# Altium schematic sheet em_storage.SchDoc
size A; SheetNumber: 5; SheetTotal: 9
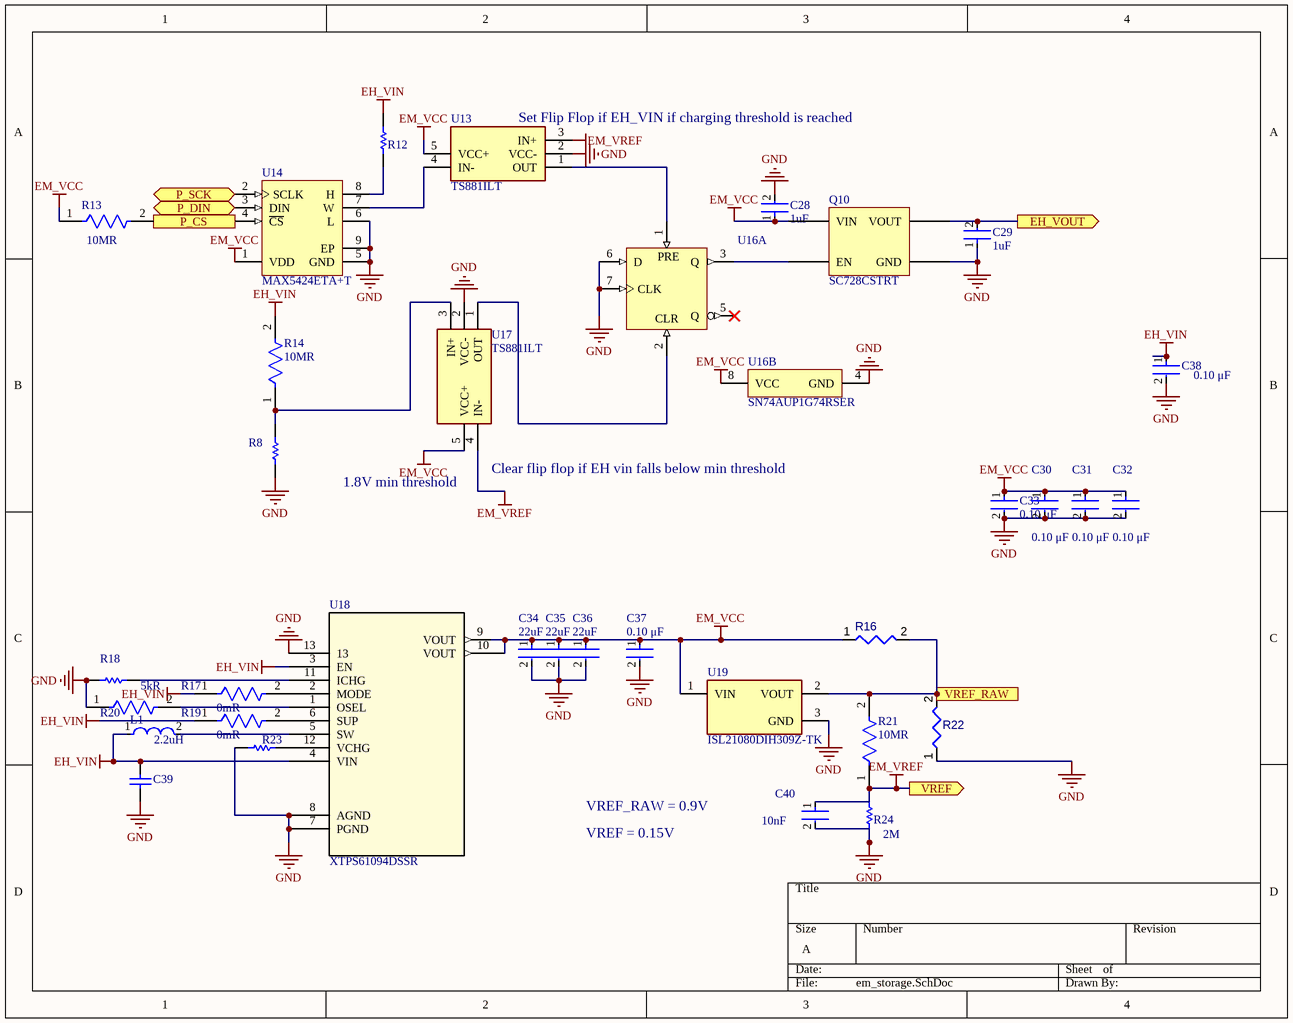
[diagram p0: em_storage.SchDoc]

## Parts
C28  Capacitance: 1uF  [FP-GRM15-0_1-MFG]  (hidden comment: GRT155R61C105KE01J)
C29  Capacitance: 1uF  [FP-GRM15-0_1-MFG]  (hidden comment: GRT155R61C105KE01J)
C30  Capacitance: 0.10 μF  [FP-C0402-BB-MFG]  (hidden comment: C0402C104K8PACTU)
C31  Capacitance: 0.10 μF  [FP-C0402-BB-MFG]  (hidden comment: C0402C104K8PACTU)
C32  Capacitance: 0.10 μF  [FP-C0402-BB-MFG]  (hidden comment: C0402C104K8PACTU)
C33  Capacitance: 0.10 μF  [FP-C0402-BB-MFG]  (hidden comment: C0402C104K8PACTU)
C34  Capacitance: 22uF  [FP-CL05A226MQ5N6J8-IPC_C]  (hidden comment: 04024D226MAT2A)
C35  Capacitance: 22uF  [FP-CL05A226MQ5N6J8-IPC_C]  (hidden comment: 04024D226MAT2A)
C36  Capacitance: 22uF  [FP-CL05A226MQ5N6J8-IPC_C]  (hidden comment: 04024D226MAT2A)
C37  Capacitance: 0.10 μF  [FP-C0402-BB-MFG]  (hidden comment: C0402C104K8PACTU)
C38  value 0.10 μF  [FP-C0402-BB-MFG]  (hidden comment: C0402C104K4RACTU)
C39  C0402C225M9PACTU  [CAPC1005X55X30NL05T10]  (value not drawn)
C40  Capacitance: 10nF  [FP-GRM155-0_05-IPC_C]  (hidden comment: GRM155R71H103KA88D)
L1  Inductance: 2.2uH  [FP-LQM21PH_G0-IPC_C]  (hidden comment: LQM21PN2R2NGCD)
Q10  SC728CSTRT  [PCBComponent_1]
R8  CRCW0805750KFKEA  [RESC2013X50X30LL20T20]  (value not drawn)
R12  RMCF0402JT2M00  [RESC1005X40X25LL05T05]  (value not drawn)
R13  Resistance: 10MR  [FP-CRCW0402-e3-IPC_C]  (hidden comment: CRCW040210M0JNED)
R14  Resistance: 10MR  [FP-CRCW0402-e3-IPC_C]  (hidden comment: CRCW040210M0JNED)
R16  Jumper 0603  [RESC0603(1608)_L]  (value not drawn)
R17  Resistance: 0mR  [FP-CRCW0402-e3-IPC_C]  (hidden comment: CRCW04020000Z0ED)
R18  RC0402JR-070RL  [RESC1005X40X25NL05T10]  (value not drawn)
R19  Resistance: 0mR  [FP-CRCW0402-e3-IPC_C]  (hidden comment: CRCW04020000Z0ED)
R20  Resistance: 5kR  [FP-PNM0402-IPC_C]  (hidden comment: PNM0402E5001BST1)
R21  Resistance: 10MR  [FP-CRCW0402-e3-IPC_C]  (hidden comment: CRCW040210M0JNED)
R22  Jumper 0603  [RESC0603(1608)_L]  (value not drawn)
R23  RC0402JR-070RL  [RESC1005X40X25NL05T10]  (value not drawn)
R24  Resistance: 2M  [RESC1005X40X25LL05T05]  (hidden comment: RMCF0402JT2M00)
U13  TS881ILT  [SOT95P280X145-5N]
U14  MAX5424ETA+T  [MAXM-T833+2_V]
U16  SN74AUP1G74RSER  [RSE0008A_V]  (value not drawn)  (parts A,B of 2)
U17  TS881ILT  [SOT95P280X145-5N]
U18  XTPS61094DSSR  [WSON_94DSSR_TEX-L]
U19  ISL21080DIH309Z-TK  [Intersil_ISL21080DIH309Z-TK_0]

## Ports
EH_VOUT (out), P_CS (in), P_DIN (bidir), P_SCK (bidir), VREF (out), VREF_RAW (out)

## Nets
EH_VIN: C38.1 C39.2 L1.1 R12.1 R14.2 R17.1 R19.1 U18.3(EN) U18.4(VIN)
EM_VCC: C28.1 C30.1 C31.1 C32.1 C33.1 C34.1 C35.1 C36.1 C37.1 Q10.A2(VIN) R13.1 R16.1 U13.5(VCC+) U14.1(VDD) U16.8(VCC) U17.5(VCC+) U18.9(VOUT) U18.10(VOUT) U19.1(VIN)
EM_VREF: C40.1 R21.1 R24.2 U13.3(IN+) U17.4(IN-) ; port VREF
GND: C28.2 C29.1 C30.2 C31.2 C32.2 C33.2 C34.2 C35.2 C36.2 C37.2 C38.2 C39.1 C40.2 Q10.B1(GND) R8.1 R18.1 R20.1 R22.1 R23.1 R24.1 U13.2(VCC-) U14.5(GND) U14.6(L) U14.9(EP) U16.4(GND) U16.6(D) U16.7(CLK) U17.2(VCC-) U18.7(PGND) U18.8(AGND) U18.13 U19.3(GND)
EH_VOUT: C29.2 Q10.A1(VOUT) ; port EH_VOUT
P_CS: R13.2 U14.4(~{CS}) ; port P_CS
P_DIN: U14.3(DIN) ; port P_DIN
P_SCK: U14.2(SCLK) ; port P_SCK
VREF_RAW: R16.2 R21.2 R22.2 U19.2(VOUT) ; port VREF_RAW
NetL1_2: L1.2 U18.5(SW)
NetQ10_B2: Q10.B2(EN) U16.3(Q)
NetR8_2: R8.2 R14.1 U17.3(IN+)
NetR12_2: R12.2 U14.8(H)
NetR17_2: R17.2 U18.2(MODE)
NetR18_2: R18.2 U18.11(ICHG)
NetR19_2: R19.2 U18.6(SUP)
NetR20_2: R20.2 U18.1(OSEL)
NetR23_2: R23.2 U18.12(VCHG)
NetU13_1: U13.1(OUT) U16.1(~{PRE})
NetU13_4: U13.4(IN-) U14.7(W)
NetU16_2: U16.2(~{CLR}) U17.1(OUT)

Not connected (* = marked no-connect by the designer): U16 5(Q)*

## Notes on the sheet
- (near U13) Set Flip Flop if EH_VIN if charging threshold is reached
- 1.8V min threshold
- (near U17) Clear flip flop if EH vin falls below min threshold
- VREF_RAW = 0.9V
- VREF = 0.15V
- (in symbol CMP-0859-00978-3, part A) PRE; CLR

## Library data of the parts
C28 C29 = CMP-2008-04556-2: CAP CER 1UF 10V X5R 0402; Manufacturer Part Number: GRM155R61A105KE15D; Manufacturer: Murata; Material: Ceramic; Tolerance: 10%; Temperature Coefficient: 15%; Octopart: https://octopart.com/grm155r61a105ke15d-murata-197442; Lead Free: Yes; ComponentLink2Description: Datasheet; Temperature: -55°C to +85°C; Temperature Range High: +85°C; Height: 0.55mm; Ipc Land Pattern Name: CAPC10050X50; ComponentLink2URL: https://search.murata.co.jp/Ceramy/image/img/A01X/G101/ENG/GRM155R61A105KE15-01A.pdf; Temperature Range Low: -55°C; Device Class L2: Capacitors; Voltage Rating: 10V; RoHS: TRUE; Device Class L1: Passive Components; Device Class L3: Ceramic Capacitors; Temperature Characteristic: X5R; Mouser Description: 0402 1 uF 10 V ±10% Tolerance X5R Surface Mount Multilayer Ceramic Capacitor; Automotive: No; Package: GRM15-0.1; Digikey Description: CAP CER 1UF 10V X5R 0402; Value: 1uF; Category: Cap
C30-C33 C37 = CMP-2008-02046-2: CAP CER 0.1UF 10V X5R 0402; Manufacturer: Kemet; Material: Ceramic; Temperature Coefficient: 15%; Tolerance: 0.1; Value: 0.10 μF; Package: C0402-BB; Temperature: -55°C to +125°C; ComponentLink2Description: Datasheet; Temperature Characteristic: X5R; Device Class L1: Passive Components; Height: 0.55mm; Lead Free: Yes; ComponentLink2URL: https://content.kemet.com/datasheets/KEM_C1002_X7R_SMD.pdf; Device Class L2: Capacitors; Temperature Range Low: -55°C; Temperature Range High: +125°C; RoHS: TRUE; Octopart: https://octopart.com/c0402c104k8pactu-kemet-140039; Automotive: No; Mouser Description: Capacitor 100 nF 10 VDC 0402; Category: Cap; Voltage Rating: 10 V; Digikey Description: CAP CER 0.1UF 10V X5R 0402; Ipc Land Pattern Name: CAPC10050X50; Device Class L3: Ceramic Capacitors; Manufacturer Part Number: C0402C104K8PACTU
C34-C36 = CMP-13271-000001-1: CAP CER 22UF 6.3V X5R 0402; Manufacturer Part Number: CL05A226MQ5N6J8; Manufacturer: Samsung Electro-Mechanics; Material: Ceramic; Temperature Coefficient: 15%; Tolerance: 20%; Ipc Land Pattern Name: CAPC10050X50; Lead Free: Yes; Temperature Characteristic: X5R; Temperature: -55°C to +85°C; RoHS: TRUE; ComponentLink2Description: Datasheet; Device Class L3: Ceramic Capacitors; Device Class L1: Passive Components; Value: 22uF; Temperature Range High: +85°C; Automotive: No; Voltage Rating: 6.3V; Package: 0402; Category: Cap; Device Class L2: Capacitors; Height: 0.55mm; ComponentLink2URL: http://www.samsungsem.com/kr/support/library/product-catalog/__icsFiles/afieldfile/2018/11/28/MLCC.pdf; Temperature Range Low: -55°C; Octopart: https://octopart.com/cl05a226mq5n6j8-samsung-82337113; Digikey Description: CAP CER 22UF 6.3V X5R 0402
C38 = CMP-2008-02108-2: CAP CER 0.1UF 16V X7R 0402; Manufacturer: Kemet; Tolerance: 0.1; Material: Ceramic; Temperature Coefficient: 15%; Voltage Rating: 16 V; Package: C0402-BB; Automotive: No; Ipc Land Pattern Name: CAPC10050X50; Device Class L3: Ceramic Capacitors; Capacitance: 0.10 μF; Octopart: https://octopart.com/c0402c104k4ractu-kemet-94158; Temperature Characteristic: X7R; Mouser Description: Cap Ceramic 0.1uF 16V X7R 10% SMD 0402 125?C Paper T/R - Tape and Reel (Alt: C0402C104K4RAC TU); ComponentLink2Description: Datasheet; Temperature Range Low: -55°C; RoHS: TRUE; Device Class L1: Passive Components; Manufacturer Part Number: C0402C104K4RACTU; Temperature Range High: +125°C; Device Class L2: Capacitors; ComponentLink2URL: https://content.kemet.com/datasheets/KEM_C1002_X7R_SMD.pdf; Category: Cap; Height: 0.55mm; Temperature: -55°C to +125°C; Lead Free: Yes; Digikey Description: CAP CER 0.1UF 16V X7R 0402
C39 = CMP-2008-02064-2: Manufacturer: Kemet; Part Number: C0402C225M9PACTU
C40 = CMP-2008-04637-5: Chip Multilayer Ceramic Capacitors for General Purpose, 0402, 10000pF, X7R, 15%, 10%, 50V; Voltage: 25V; Tolerance: 10%; Mount: Surface Mount; Lead Free: Lead Free; Radiation Hardening: No; Case Code (Imperial): 0402; REACH SVHC: No SVHC; Case/Package: 0402; Dielectric: X7R; Voltage Rating (DC): 50V; Max Operating Temperature: 125°C; Termination: SMD/SMT; Material: Ceramic; Width: 0.02inch; Package Quantity: 1; Voltage Rating: 50V; Thickness: 0.022inch; Packaging: Tape and Reel; Height: 0.5mm; Number of Pins: 2; Case Code (Metric): 1005; Min Operating Temperature: -55°C; Length: 1mm; Depth: 0.5mm
L1 = CMP-06042-016317-1: Multilayer Type Inductor for Power Lines, 0805 (2012), 2.2μH, 30%, 0.288Ω, 0.8A; Test Frequency: 1MHz; Shielding: Shielded; Current Rating: 800mA; Self Resonant Frequency: 40MHz; Core Material: Ferrite; DC Resistance (DCR): 288mR; RoHS Compliant: Yes; REACH SVHC: No SVHC; Inductance Tolerance: 30%; Package Quantity: 4000; Military Standard: Not; Max Operating Temperature: 125°C; Radiation Hardening: No; Series: LQM; Height - Seated (Max): 0.039inch; Tolerance: 30%; Height: 0.9mm; Lead Free: Lead Free; Case Code (Metric): 2012; Packaging: Tape and Reel; Termination: SMD/SMT; Case Code (Imperial): 0805; Min Operating Temperature: -55°C; Depth: 1.4mm; Mount: Surface Mount; Length: 2mm; DC Current: 800mA; Case/Package: 0805; Max DC Current: 800mA; Width: 0.049inch
R8 = CMP-2001-04102-1: Manufacturer: Vishay Dale; Part Number: CRCW0805750KFKEA
R12 = CMP-1011-00881-2: Manufacturer: Vishay Dale; Part Number: CRCW04022M00FKED; Resistance: 2M Ohm
R13 R14 R21 = CMP-1011-00170-3: RES Thick Film, 10MΩ, 5%, 0.063W, 200ppm/°C, 0402; Voltage Rating (DC): 50V; Max Power Dissipation: 63mW; Case Code (Metric): 1005; Tolerance: 5%; Lead Free: Lead Free; Length: 1mm; Packaging: Tape and Reel; Depth: 0.5mm; Composition: Thick Film; Temperature Coefficient: 200ppm/°C; Package Quantity: 1; Radiation Hardening: No; Weight: 2.3E-05oz; Width: 0.5mm; Military Standard: Not; Power Rating: 63mW; Case/Package: 0402; Termination: SMD/SMT; Height: 0.016inch; Voltage Rating: 50V; Contact Plating: Tin; Number of Terminations: 2; Features: Automotive AEC-Q200; Max Operating Temperature: 155°C; Case Code (Imperial): 0402; Min Operating Temperature: -55°C
R16 R22 = CMP-009-00175-3: Value: 0; Pins: 2; Min Operating Temperature: -55°C; Max Operating Temperature: 155°C; Case/Package: 0603
R17 R19 = CMP-2002-08122-2: RES Thick Film, 0Ω, 0.063W, 0402; Tolerance: 5%; Max Power Dissipation: 63mW; Voltage Rating: 50V; Temperature Coefficient: 100ppm/°C; Contact Plating: Tin; Height: 0.35mm; Radiation Hardening: No; Features: Automotive AEC-Q200; Composition: Thick Film; Width: 0.5mm; Weight: 2.3E-05oz; Termination: SMD/SMT; Packaging: Tape and Reel; Mount: Surface Mount; Case Code (Metric): 1005; Military Standard: Not; Min Operating Temperature: -55°C; Number of Terminations: 2; Package Quantity: 1; Case Code (Imperial): 0402; Depth: 0.5mm; Max Operating Temperature: 155°C; Case/Package: 0402; Power Rating: 63mW; Lead Free: Lead Free; Voltage Rating (DC): 50V; Length: 1mm
R18 R23 = CMP-1011-00001-2: Manufacturer: Yageo / Phycomp; Part Number: RC0402JR-070RL
R20 = CMP-02407-012302-1: RES SMD 5K OHM 0.1% 1/20W 0402; Temperature Coefficient: 25ppm/°C; Max Power Dissipation: 50mW; Width: 0.022inch; Height: 0.033inch; Tolerance: 0.1%; Number of Terminations: 2; Packaging: Tape and Reel; RoHS Compliant: Yes; Case Code (Imperial): 0402; Min Operating Temperature: -55°C; Case Code (Metric): 1005; Features: Moisture Resistant; Max Operating Temperature: 155°C; Package Quantity: 1000; Resistor Type: Thin Film; Length: 0.042inch; Case/Package: 0402
R24 = CMP-1011-00881-2: Manufacturer: Vishay Dale; Part Number: CRCW04022M00FKED
U13 U17 = TS881ILT: Integrated Circuit; Manufacturer_Name: STMicroelectronics; Datasheet Link: http://www.st.com/resource/en/datasheet/DM00057901.pdf; Height: 1.45mm; Manufacturer_Part_Number: TS881ILT
U14 = CMP-0023-00299-1: 200kOhm, Digital Potentiometer with 3-Wire Serial SPI Control Interface, Non-Volatile, Linear Taper, 256 Steps, -40 to 85 degC, 8-pin TDFN-EP (T833+2), Pb-Free, Tape and Reel; PartNumber: MAX5424ETA+T; ComponentLink3URL: http://pdfserv.maximintegrated.com/package_dwgs/21-0137.PDF; PackageDescription: 8-Pin Plastic Very Very Thin Dual Flatpack No Leads, Exposed Pad (T833+2); PackageVersion: Rev. J, 08/2009; ComponentLink2Description: Datasheet; ComponentLink1Description: Manufacturer URL; ComponentLink2URL: http://datasheets.maximintegrated.com/en/ds/MAX5422-MAX5424.pdf; Code_JEDEC: MO229; ComponentLink1URL: http://www.maximintegrated.com/; PackageReference: T833+2; Control Interface: 3-Wire Serial SPI; Features: EEPROM Wiper Memory; DatasheetVersion: Rev. 0; Mounting Technology: Surface Mount; ComponentLink3Description: Package Specification
U16 = CMP-0859-00978-3: Low-Power Single Positive-Edge-Triggered D-Type Flip-Flop, RSE0008A, LARGE T&R; Manufacturer: Texas Instruments; Bits(#): 1; VCC(Max)(V): 3.6; Voltage(Nom)(V): 0.8,1.2,1.5,1.8,2.5,3.3; Output Type: CMOS; Technology Family: AUP; VCC(Min)(V): 0.8; ICC @ Nom Voltage(Max)(mA): 0.0009; F @ Nom Voltage(Max)(Mhz): 100; Output Drive (IOL/IOH)(Max)(mA): 20/-20; Rating: Catalog; Schmitt Trigger: No; tpd @ Nom Voltage(Max)(ns): 38,26,17,13,9,7; Logic: True; Generic Part Number: SN74AUP1G74; Operating Temperature Range(C): -40 to 85; DatasheetVersion: SCES644C; Sub-Family: D-Type Flip-Flop; 3-State Output: No; PackageReference: RSE0008A; Input Type: CMOS
U18 = XTPS61094DSSR: No Description Available; SourceLibrary: Add_to_database_2021-03-17; Built_By: EMA_Matt; Vendor: Texas Instruments; Datasheet: https://www.ti.com/lit/ds/symlink/tps61094.pdf?ts=1615883226162; Manufacturer_Part_Number: XTPS61094DSSR; Copyright: Copyright (C) 2018 Accelerated Designs. All rights reserved; RefDes: RefDes; Type: DEV
U19 = IC_Intersil_ISL21080DIH309Z-TK_eec: IC VREF SERIES 0.9V SOT23-3; Part Number: ISL21080DIH309Z-TK; helpURL: https://upverter.com/upn/revision/cea4d3e56c7c7365/; ComponentLink2Description: Datasheet; Temperature: -40°C to +85°C; Package: SOT23-3; Supplier 2: Mouser; Price: 1.15623202851; Supplier 1: Digi-Key; ComponentLink1URL: https://upverter.com/upn/revision/cea4d3e56c7c7365/; Supplier Part Number 2: 968-ISL21080DIH309ZT; Supplier Part Number 1: ISL21080DIH309Z-TKCT-ND; Manufacturer: Intersil; ComponentLink1Description: Upverter; ComponentLink2URL: https://www.intersil.com/content/dam/Intersil/documents/isl2/isl21080.pdf; RoHS: TRUE; Mouser Part Number: 968-ISL21080DIH309ZT; Temperature Range High: +85°C; Digikey Description: IC VREF SERIES 0.9V SOT23-3; Digikey Part Number: ISL21080DIH309Z-TKCT-ND; Lead Free: yes; Temperature Range Low: -40°C